# EasyEDA Pro project ProPrj_HTXStudio_OneHanded_Keyboard.epro, schematic 方向按键
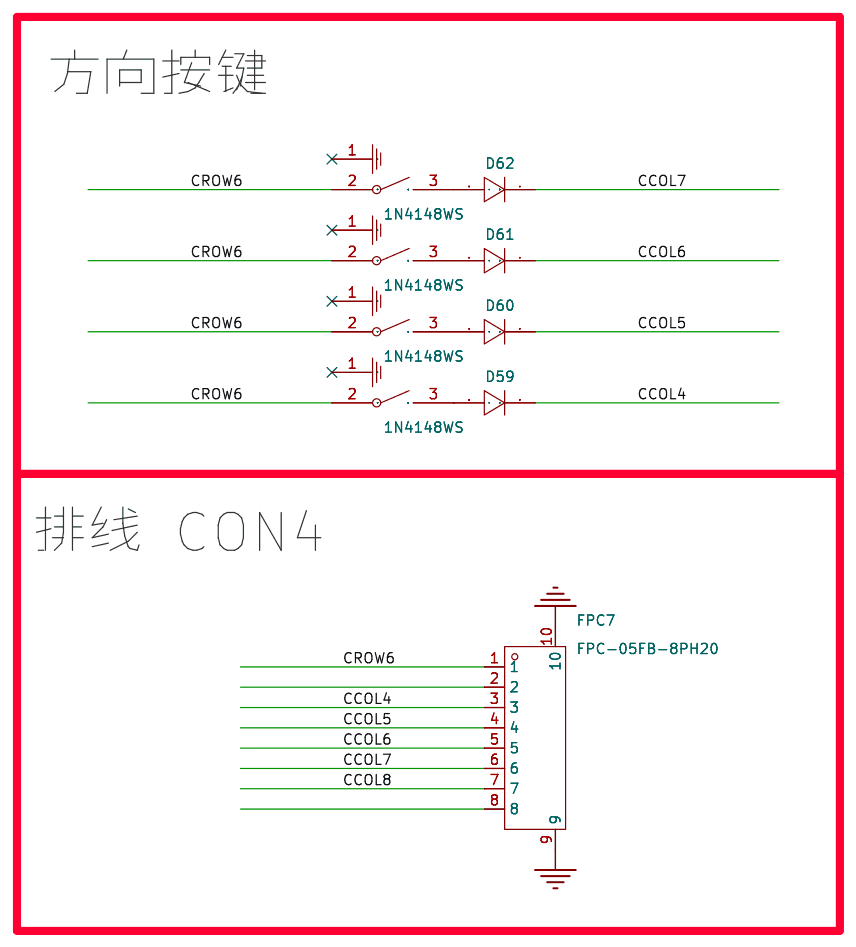
[diagram p2: schematic sheet]

## Parts
D59  1N4148WS  [SOD-323_L1.8-W1.3-LS2.5-RD]
D60  1N4148WS  [SOD-323_L1.8-W1.3-LS2.5-RD]
D61  1N4148WS  [SOD-323_L1.8-W1.3-LS2.5-RD]
D62  1N4148WS  [SOD-323_L1.8-W1.3-LS2.5-RD]
FPC7  FPC-05FB-8PH20  [FPC-SMD_8P-P0.50_XUNPU_FPC-05FB-8PH20]
K18  -  [ALPS_键盘轴]
K19  -  [ALPS_键盘轴]
K20  -  [ALPS_键盘轴]
K21  -  [ALPS_键盘轴]

## Library data of the parts
D59-D62 = 1N4148WS_C437156: 二极管配置:独立式;正向压降(Vf):1.25V@150mA;直流反向耐压(Vr):100V;整流电流:150mA;反向恢复时间(trr):4ns;; LCSC Part Name: 电压:100V 电流:150mA; Supplier Part: C437156; Manufacturer: MDD(辰达半导体); Supplier Footprint: SOD-323; JLCPCB Part Class: 扩展库; Datasheet: https://atta.szlcsc.com/upload/public/pdf/source/20230823/12C4B88004F768DBC940AB716F9D26AA.pdf; Supplier: LCSC; Diode Configuration: 独立式; Forward Voltage (Vf@If): 1.25V@150mA; Reverse Voltage (Vr): 100V; Rectified Current: 150mA; Reverse Leakage Current: 25nA@20V; Reverse Recovery Time (trr): 4ns; Operating Temperature: -55℃~+150℃@(Tj)
FPC7 = FPC-05FB-8PH20: 锁定特性:翻盖式;触点类型:双侧触点/上下接;触点数量:8P;间距:0.5mm;安装类型:卧贴;工作温度范围:-25℃~+85℃;; LCSC Part Name: 间距:0.5mm P数:8P 翻盖式 双侧触点/上下接; Supplier Part: C2856828; Manufacturer: XUNPU(讯普); Supplier Footprint: SMD,P=0.5mm,卧贴; JLCPCB Part Class: 扩展库; Datasheet: https://atta.szlcsc.com/upload/public/pdf/source/20210922/C2856828_96968FB666CC1781EEE4F204CBA73B0B.pdf; Supplier: LCSC; Locking Feature: 翻盖式; Contact Type: 双侧触点/上下接; Number of Contacts: 8P; Pitch: 0.5mm; Mounting Type: 卧贴; FFC, FCB Thickness: 0.3mm; Height Above Board: 2mm; Operating Temperature Range: -25℃~+85℃
K18-K21 = ALPS_键盘轴

## Nets
GND: FPC7.9 FPC7.10
CCOL4: D59.1(C) FPC7.3
CCOL5: D60.1(C) FPC7.4
CCOL6: D61.1(C) FPC7.5
CCOL7: D62.1(C) FPC7.6
CCOL8: FPC7.7
CROW6: FPC7.1 K18.2 K19.2 K20.2 K21.2
$1N260: D59.2(A) K21.3
$1N299: D60.2(A) K20.3
$1N338: D61.2(A) K19.3
$1N377: D62.2(A) K18.3

Not connected (* = marked no-connect by the designer): FPC7 2 8; K18 1*; K19 1*; K20 1*; K21 1*

## Notes on the sheet
- 方向按键
- 排线 CON4
